# Altium schematic sheet ATtiny.SchDoc
size A4; SheetNumber: 2; SheetTotal: 8
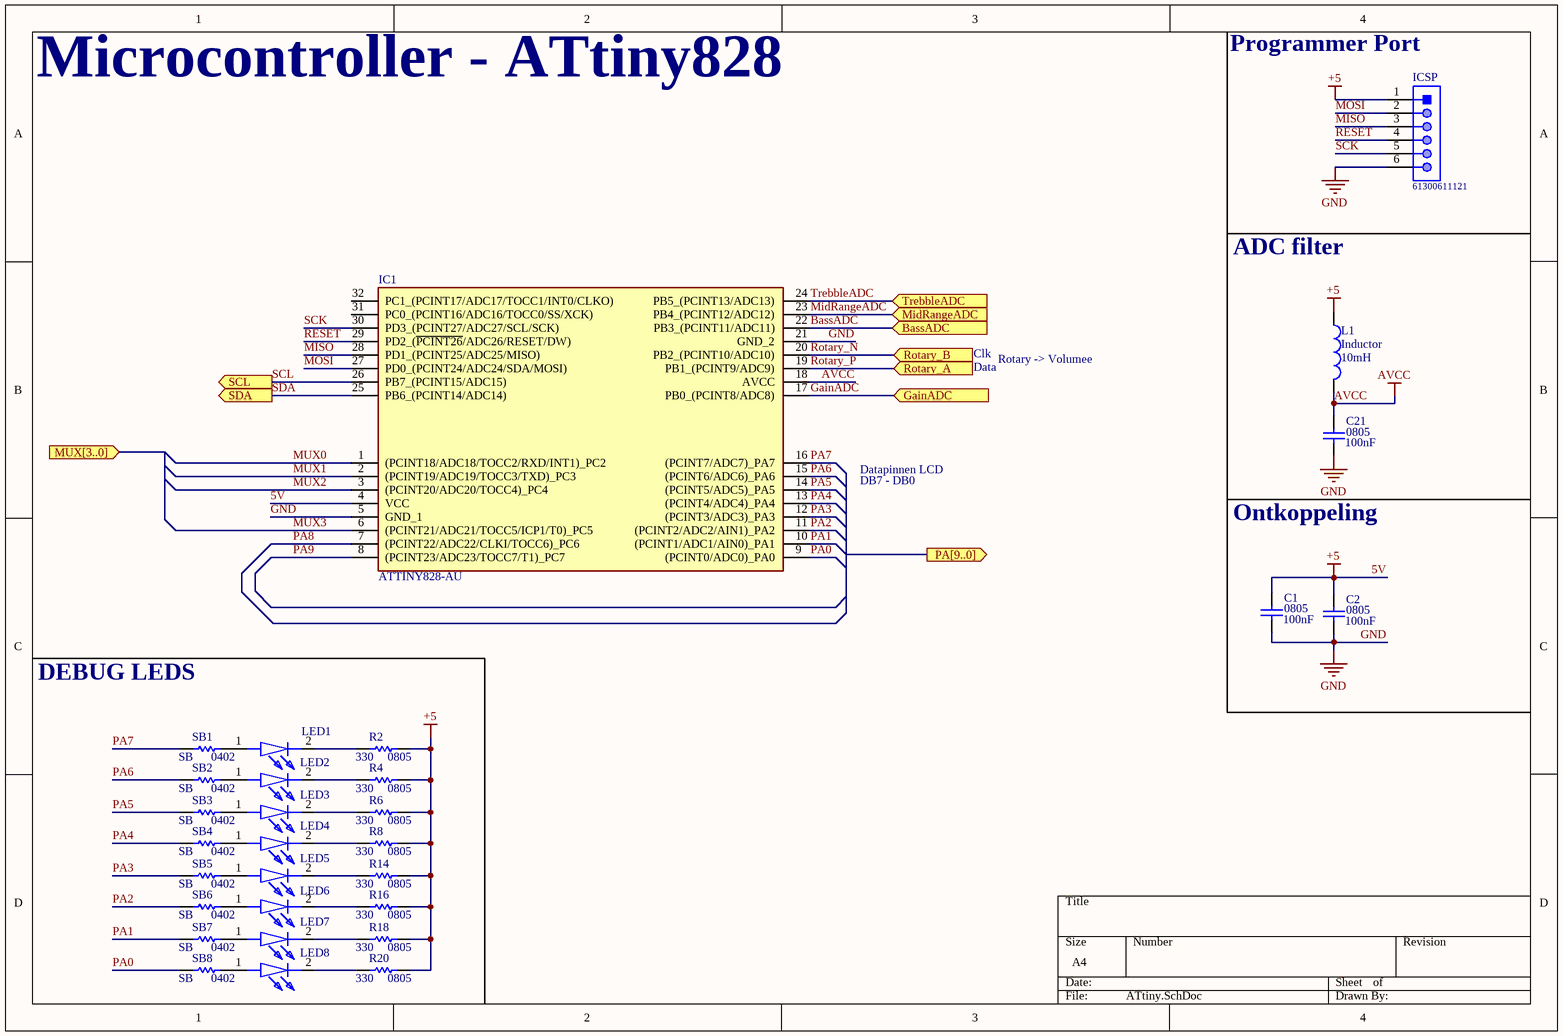
[diagram p0: ATtiny.SchDoc]

## Parts
C1  0805  value 100nF  [6-0805_N]
C2  0805  value 100nF  [6-0805_N]
C21  0805  value 100nF  [6-0805_N]
IC1  ATTINY828-AU  [QFP80P900X900X120-32N]
ICSP  61300611121  [61300611121]
L1  Inductor  value 10mH  [2220]
LED1  ELM70303GD  [ELM70303GD]  (value not drawn)
LED2  ELM70303GD  [ELM70303GD]  (value not drawn)
LED3  ELM70303GD  [ELM70303GD]  (value not drawn)
LED4  ELM70303GD  [ELM70303GD]  (value not drawn)
LED5  ELM70303GD  [ELM70303GD]  (value not drawn)
LED6  ELM70303GD  [ELM70303GD]  (value not drawn)
LED7  ELM70303GD  [ELM70303GD]  (value not drawn)
LED8  ELM70303GD  [ELM70303GD]  (value not drawn)
R2  0805  value 330  [6-0805_N]
R4  0805  value 330  [6-0805_N]
R6  0805  value 330  [6-0805_N]
R8  0805  value 330  [6-0805_N]
R14  0805  value 330  [6-0805_N]
R16  0805  value 330  [6-0805_N]
R18  0805  value 330  [6-0805_N]
R20  0805  value 330  [6-0805_N]
SB1  0402  value SB  [0402]
SB2  0402  value SB  [0402]
SB3  0402  value SB  [0402]
SB4  0402  value SB  [0402]
SB5  0402  value SB  [0402]
SB6  0402  value SB  [0402]
SB7  0402  value SB  [0402]
SB8  0402  value SB  [0402]

## Ports
BassADC (in, see Main[3C], FrontIO[4A]), GainADC (in, see Main[3C], FrontIO[4B]), MidRangeADC (in, see Main[3C], FrontIO[4A]), MUX[3..0] (in, see Main[3C], FrontIO[2A]), PA[9..0] (out, see Main[3C], FrontIO[1B]), Rotary_A (in, see Main[3D], FrontIO[3B]), Rotary_B (in, see Main[3D], FrontIO[3B]), SCL (out, see Main[3C], TDA7439DS[2B]), SDA (out, see Main[3C], TDA7439DS[2B]), TrebbleADC (in, see Main[3C], FrontIO[3A])

## Nets
5V: C1.1 C2.1 IC1.4(VCC) ICSP.1 L1.1 R2.1 R4.1 R6.1 R8.1 R14.1 R16.1 R18.1 R20.1  [also labelled +5]
AVCC: C21.1 IC1.18(AVCC) L1.2
GND: C1.2 C2.2 C21.2 IC1.5(GND_1) IC1.21(GND_2) ICSP.6
BassADC: IC1.22(PB3_(PCINT11/ADC11)) ; port BassADC
GainADC: IC1.17(PB0_(PCINT8/ADC8)) ; port GainADC
MidRangeADC: IC1.23(PB4_(PCINT12/ADC12)) ; port MidRangeADC
MISO: IC1.28(PD1_(PCINT25/ADC25/MISO)) ICSP.3
MOSI: IC1.27(PD0_(PCINT24/ADC24/SDA/MOSI)) ICSP.2
MUX0: IC1.1((PCINT18/ADC18/TOCC2/RXD/INT1)_PC2)
MUX1: IC1.2((PCINT19/ADC19/TOCC3/TXD)_PC3)
MUX2: IC1.3((PCINT20/ADC20/TOCC4)_PC4)
MUX3: IC1.6((PCINT21/ADC21/TOCC5/ICP1/T0)_PC5)
PA0: IC1.9((PCINT0/ADC0)_PA0) SB8.2
PA1: IC1.10((PCINT1/ADC1/AIN0)_PA1) SB7.2
PA2: IC1.11((PCINT2/ADC2/AIN1)_PA2) SB6.2
PA3: IC1.12((PCINT3/ADC3)_PA3) SB5.2
PA4: IC1.13((PCINT4/ADC4)_PA4) SB4.2
PA5: IC1.14((PCINT5/ADC5)_PA5) SB3.2
PA6: IC1.15((PCINT6/ADC6)_PA6) SB2.2
PA7: IC1.16((PCINT7/ADC7)_PA7) SB1.2
PA8: IC1.7((PCINT22/ADC22/CLKI/TOCC6)_PC6)
PA9: IC1.8((PCINT23/ADC23/TOCC7/T1)_PC7)
RESET: IC1.29(PD2_(~{PCINT26}/ADC26/RESET/DW)) ICSP.4
Rotary_N: IC1.20(PB2_(PCINT10/ADC10)) ; port Rotary_B
Rotary_P: IC1.19(PB1_(PCINT9/ADC9)) ; port Rotary_A
SCK: IC1.30(PD3_(PCINT27/ADC27/SCL/SCK)) ICSP.5
SCL: IC1.26(PB7_(PCINT15/ADC15)) ; port SCL
SDA: IC1.25(PB6_(PCINT14/ADC14)) ; port SDA
TrebbleADC: IC1.24(PB5_(PCINT13/ADC13)) ; port TrebbleADC
NetLED1_1: LED1.1(A) SB1.1
NetLED1_2: LED1.2(K) R2.2
NetLED2_1: LED2.1(A) SB2.1
NetLED2_2: LED2.2(K) R4.2
NetLED3_1: LED3.1(A) SB3.1
NetLED3_2: LED3.2(K) R6.2
NetLED4_1: LED4.1(A) SB4.1
NetLED4_2: LED4.2(K) R8.2
NetLED5_1: LED5.1(A) SB5.1
NetLED5_2: LED5.2(K) R14.2
NetLED6_1: LED6.1(A) SB6.1
NetLED6_2: LED6.2(K) R16.2
NetLED7_1: LED7.1(A) SB7.1
NetLED7_2: LED7.2(K) R18.2
NetLED8_1: LED8.1(A) SB8.1
NetLED8_2: LED8.2(K) R20.2

Not connected (* = marked no-connect by the designer): IC1 31(PC0_(PCINT16/ADC16/TOCC0/SS/XCK)) 32(PC1_(PCINT17/ADC17/TOCC1/INT0/CLKO))

## Notes on the sheet
- Microcontroller - ATtiny828
- (near ICSP) Programmer Port
- ADC filter
- Clk
- Data <Clk>
- Rotary -> Volumee
- Datapinnen LCD
- DB7 - DB0
- Ontkoppeling
- DEBUG LEDS

## Library data of the parts
C1 C2 C21 = Cap: Capacitor; Published: 8-Jun-2000; LatestRevisionDate: 17-Jul-2002; LatestRevisionNote: Re-released for DXP Platform.; PackageReference: RAD-0.3; Publisher: Altium Limited; PackageDescription: Radial Cap, Thru-Hole; 2 Leads; 0.3 in Pin Spacing
IC1 = ATTINY828-AU: Integrated Circuit; Manufacturer_Name: Microchip; Datasheet Link: http://ww1.microchip.com/downloads/en/DeviceDoc/doc8371.pdf; Height: 1.2mm; Manufacturer_Part_Number: ATTINY828-AU
ICSP = CMP-1502-01070-1: THT Vertical Pin Header WR-PHD, Pitch 2.54 mm, Single Row, 6 pins; Manufacturer: Wurth Elektronik; Gender: Male; Pin Number: 6; Pitch: 2.54mm; Working Voltage: 250VAC; Rated Current: 3A; Withstanding Voltage: 500VAC; Contact Resistance: 20mOhm; Operating Temperature: -40to105degC; Packaging: Bag; Datasheet URL: https://katalog.we-online.de/em/datasheet/6130xx11121.pdf; Package Reference: 61300611121; Mounting Technology: THT; Publisher: WurthElektronik; Part Number: 61300611121; Manufacturer URL: http://www.we-online.de; Row Number: Single; Orientation: Vertical
L1 = Inductor: Code_IEC: 1005; Published: 8-Jun-2000; LatestRevisionDate: 29-May-2009; LatestRevisionNote: IPC-7351 Footprint Added.; PackageReference: 0402-A; Publisher: Altium Limited; PackageDescription: Chip Inductor; Code_JEITA: 0402
LED1-LED8 = ELM70303GD: LED; Manufacturer_Name: Bivar; Datasheet Link: https://componentsearchengine.com/Datasheets/2/ELM70303GD.pdf; Height: 5.4mm; Manufacturer_Part_Number: ELM70303GD; Mouser Part Number: 749-ELM70303GD; Mouser Price/Stock: https://www.mouser.co.uk/ProductDetail/Bivar/ELM70303GD?qs=RaByzyhmEWg099B9bvH9wg%3D%3D
R2 R4 R6 R8 R14 R16 R18 R20 SB1-SB8 = Res1: Resistor; Published: 8-Jun-2000; LatestRevisionDate: 17-Jul-2002; LatestRevisionNote: Re-released for DXP Platform.; PackageReference: AXIAL-0.3; Publisher: Altium Limited; PackageDescription: Axial Device, Thru-Hole; 2 Leads; 0.3 in Pin Spacing